# EAGLE design MCP Teensy (EAGLE 7.6.0)
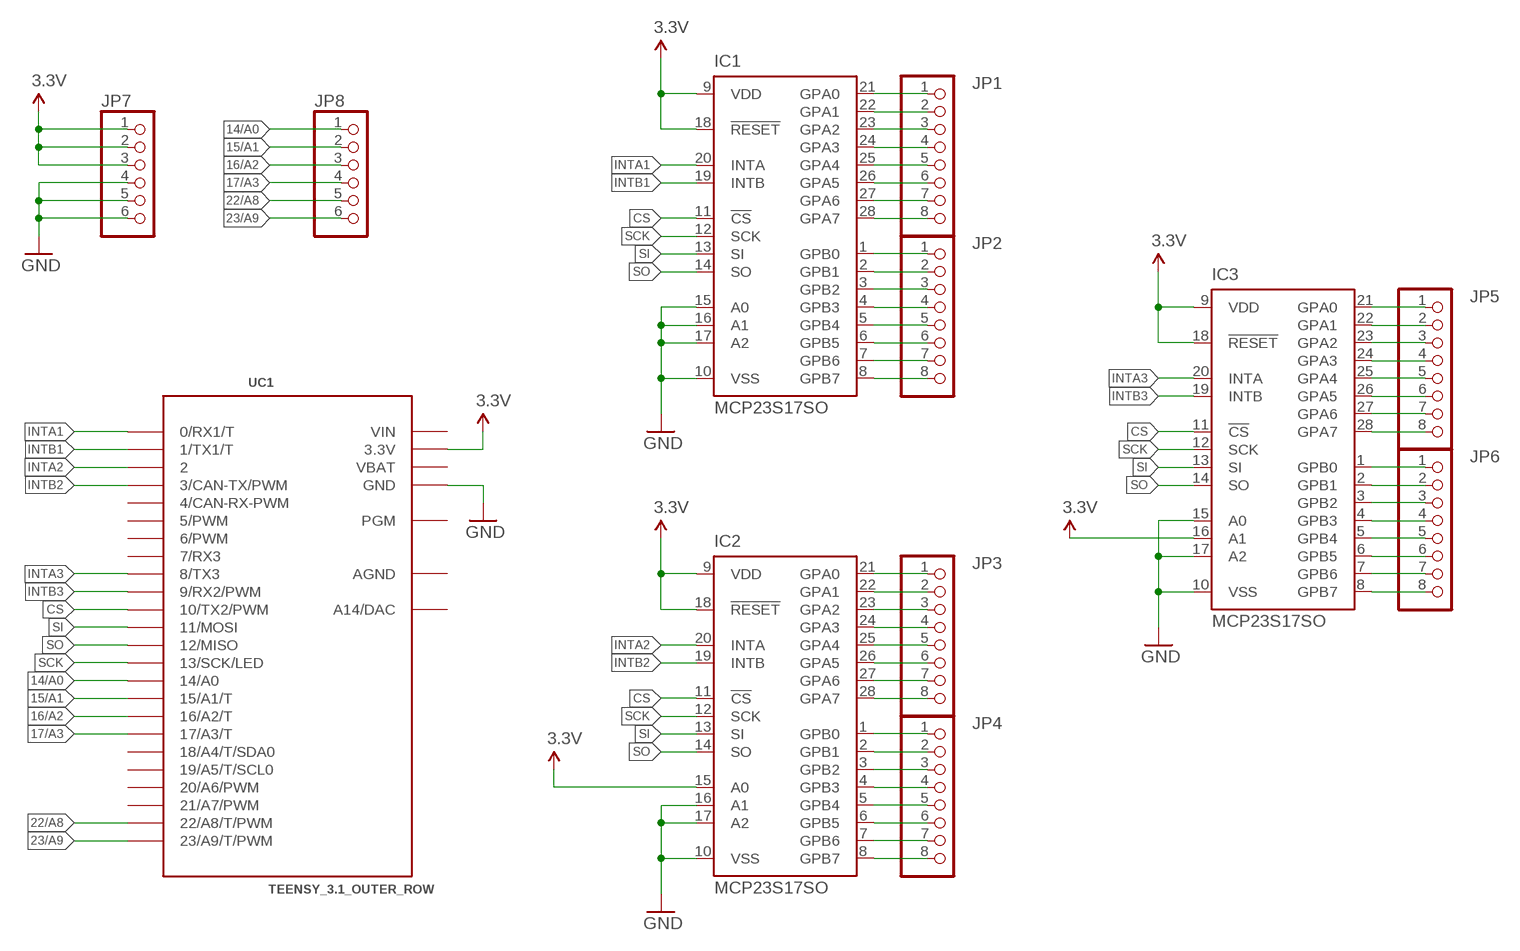
[diagram p0: schematic, sheet 1]

## Parts
IC1  MCP23S17SO  [SO28W]
IC2  MCP23S17SO  [SO28W]
IC3  MCP23S17SO  [SO28W]
JP1  PINHD-1X8LOCK  [1X08-LOCK]
JP2  PINHD-1X8LOCK  [1X08-LOCK]
JP3  PINHD-1X8LOCK  [1X08-LOCK]
JP4  PINHD-1X8LOCK  [1X08-LOCK]
JP5  PINHD-1X8LOCK  [1X08-LOCK]
JP6  PINHD-1X8LOCK  [1X08-LOCK]
JP7  PINHD-1X6LOCK  [1X06-BIGLOCK]
JP8  PINHD-1X6LOCK  [1X06-BIGLOCK]
UC1  TEENSY_3.1_OUTER_ROW  [TEENSY3-OUTER_ROW]

## Nets
3.3V: IC1.9(VDD) IC1.18(!RESET) IC2.9(VDD) IC2.15(A0) IC2.18(!RESET) IC3.9(VDD) IC3.16(A1) IC3.18(!RESET) JP7.1 JP7.2 JP7.3 UC1.3.3V UC1.3.3V1(3.3V)
14/A0: JP8.1 UC1.14/A0
15/A1: JP8.2 UC1.15/A1(15/A1/T)
16/A2: JP8.3 UC1.16/A2(16/A2/T)
17/A3: JP8.4 UC1.17/A3(17/A3/T)
22/A8: JP8.5 UC1.22/A8(22/A8/T/PWM)
23/A9: JP8.6 UC1.23/A9(23/A9/T/PWM)
CS: IC1.11(!CS) IC2.11(!CS) IC3.11(!CS) UC1.10(10/TX2/PWM)
GND: IC1.10(VSS) IC1.15(A0) IC1.16(A1) IC1.17(A2) IC2.10(VSS) IC2.16(A1) IC2.17(A2) IC3.10(VSS) IC3.15(A0) IC3.17(A2) JP7.4 JP7.5 JP7.6 UC1.GND UC1.GND1(GND)
INTA1: IC1.20(INTA) UC1.0(0/RX1/T)
INTA2: IC2.20(INTA) UC1.2
INTA3: IC3.20(INTA) UC1.8(8/TX3)
INTB1: IC1.19(INTB) UC1.1(1/TX1/T)
INTB2: IC2.19(INTB) UC1.3(3/CAN-TX/PWM)
INTB3: IC3.19(INTB) UC1.9(9/RX2/PWM)
N$1: IC1.21(GPA0) JP1.1
N$2: IC1.22(GPA1) JP1.2
N$3: IC1.23(GPA2) JP1.3
N$4: IC1.24(GPA3) JP1.4
N$5: IC1.25(GPA4) JP1.5
N$6: IC1.26(GPA5) JP1.6
N$7: IC1.27(GPA6) JP1.7
N$8: IC1.28(GPA7) JP1.8
N$9: IC1.1(GPB0) JP2.1
N$10: IC1.2(GPB1) JP2.2
N$11: IC1.3(GPB2) JP2.3
N$12: IC1.4(GPB3) JP2.4
N$13: IC1.5(GPB4) JP2.5
N$14: IC1.6(GPB5) JP2.6
N$15: IC1.7(GPB6) JP2.7
N$16: IC1.8(GPB7) JP2.8
N$17: IC2.21(GPA0) JP3.1
N$18: IC2.22(GPA1) JP3.2
N$19: IC2.23(GPA2) JP3.3
N$20: IC2.24(GPA3) JP3.4
N$21: IC2.25(GPA4) JP3.5
N$22: IC2.26(GPA5) JP3.6
N$26: IC2.27(GPA6) JP3.7
N$27: IC2.28(GPA7) JP3.8
N$28: IC2.1(GPB0) JP4.1
N$29: IC2.2(GPB1) JP4.2
N$30: IC2.3(GPB2) JP4.3
N$31: IC2.4(GPB3) JP4.4
N$32: IC2.5(GPB4) JP4.5
N$33: IC2.6(GPB5) JP4.6
N$34: IC2.7(GPB6) JP4.7
N$35: IC2.8(GPB7) JP4.8
N$39: IC3.21(GPA0) JP5.1
N$40: IC3.22(GPA1) JP5.2
N$41: IC3.23(GPA2) JP5.3
N$42: IC3.24(GPA3) JP5.4
N$43: IC3.25(GPA4) JP5.5
N$44: IC3.26(GPA5) JP5.6
N$45: IC3.27(GPA6) JP5.7
N$46: IC3.28(GPA7) JP5.8
N$47: IC3.1(GPB0) JP6.1
N$48: IC3.2(GPB1) JP6.2
N$49: IC3.3(GPB2) JP6.3
N$50: IC3.4(GPB3) JP6.4
N$51: IC3.5(GPB4) JP6.5
N$52: IC3.6(GPB5) JP6.6
N$53: IC3.7(GPB6) JP6.7
N$54: IC3.8(GPB7) JP6.8
SCK: IC1.12(SCK) IC2.12(SCK) IC3.12(SCK) UC1.13(13/SCK/LED)
SI: IC1.13(SI) IC2.13(SI) IC3.13(SI) UC1.11(11/MOSI)
SO: IC1.14(SO) IC2.14(SO) IC3.14(SO) UC1.12(12/MISO)
Unconnected: UC1.4(4/CAN-RX-PWM) UC1.5(5/PWM) UC1.6(6/PWM) UC1.7(7/RX3) UC1.18/A4(18/A4/T/SDA0) UC1.19/A5(19/A5/T/SCL0) UC1.20/A6(20/A6/PWM) UC1.21/A7(21/A7/PWM) UC1.PGM UC1.RESET/DAC(A14/DAC)

## Power pins joined to a net without a drawn wire
AGND: UC1.AGND
VBAT: UC1.VBAT
VIN: UC1.VIN

## Library data of the parts
IC1-IC3 = microchip:MCP23S17: http://ww1.microchip.com/downloads/en/DeviceDoc/21952a.pdf Source: http://ww1.microchip.com/downloads/en/DeviceDoc/21952a.pdf; MF: MICROCHIP; MPN: MCP23S17-E/SO; OC_FARNELL: unknown; OC_NEWARK: 31K2950
JP1-JP6 = adafruit:PINHD-1X8: PIN HEADER
JP7 JP8 = adafruit:PINHD-1X6: PIN HEADER
UC1 = Teensy_3_and_LC_Series_Boards_v1.1:TEENSY_3.1_OUTER_ROW: Footprint for Teensy 3.1 or 3.2 board using all pin connections on the outer perimeter

## Board
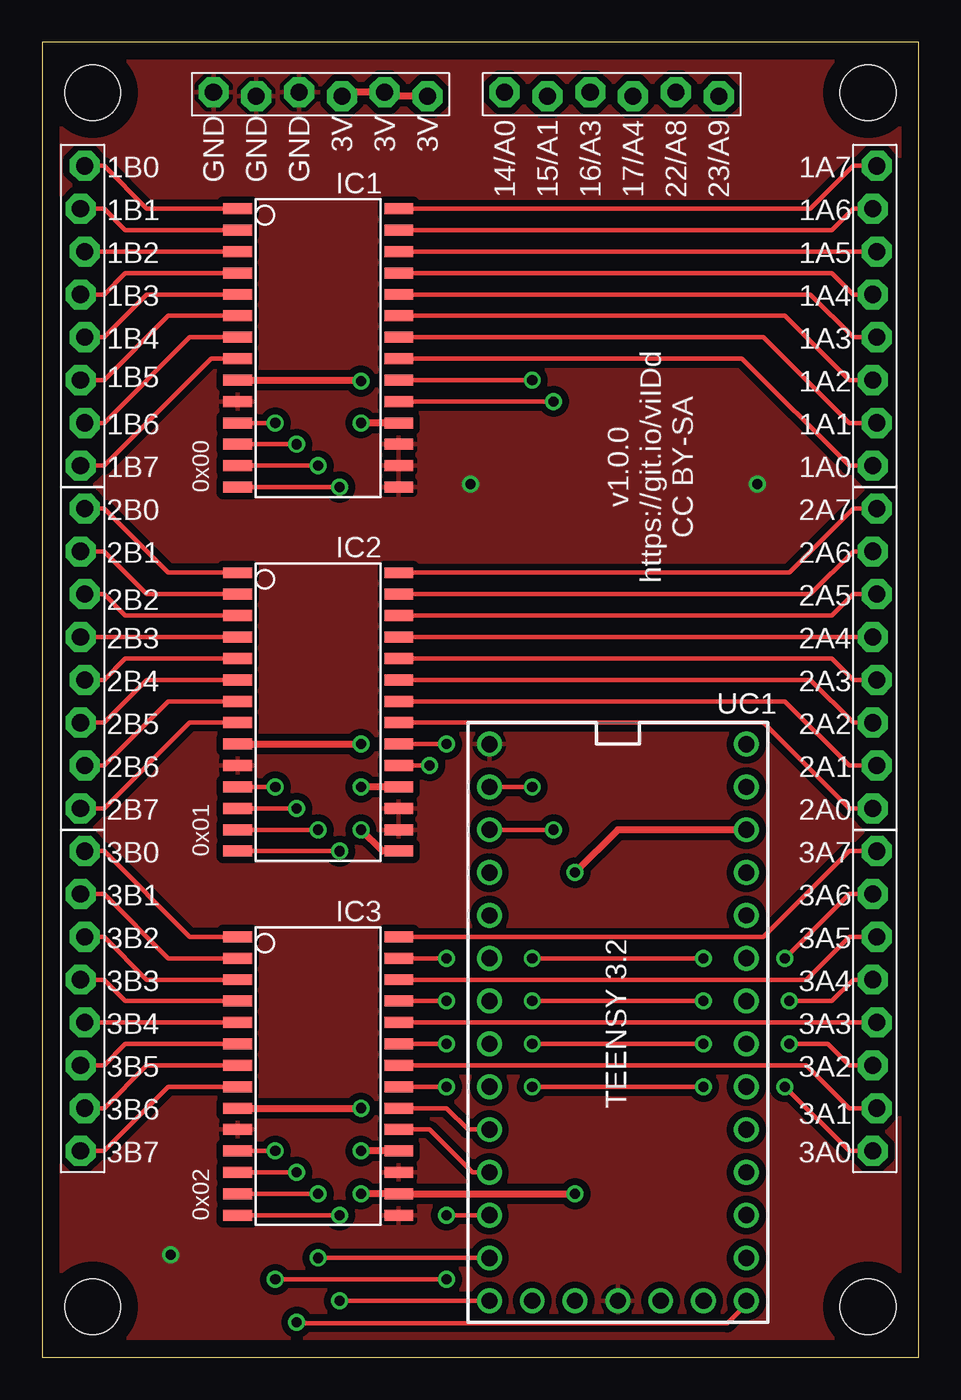
[diagram p1: board, top side]
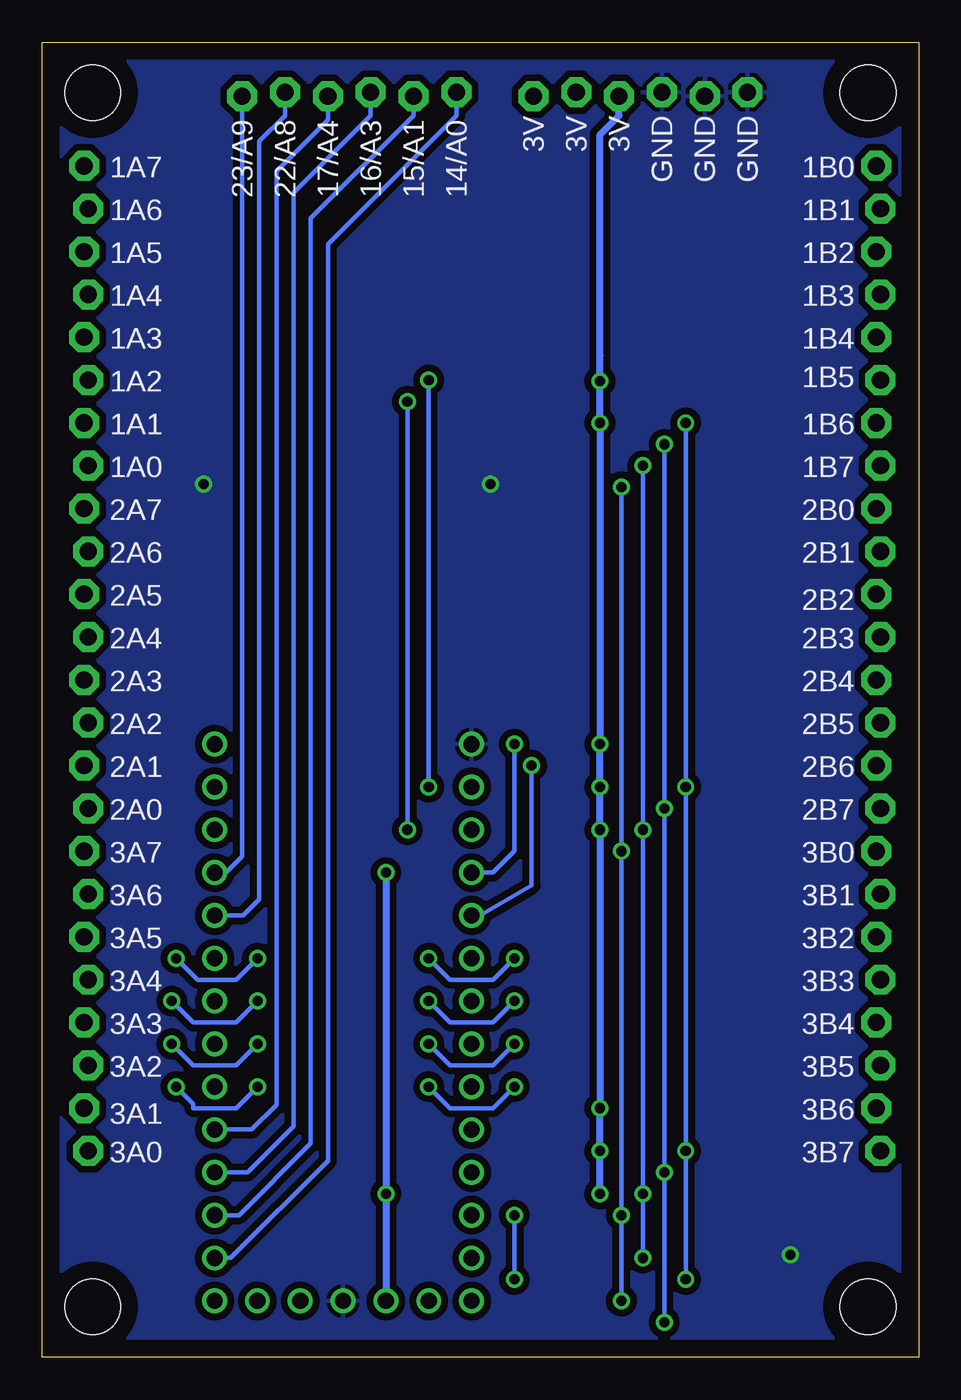
[diagram p2: board, bottom side, seen from below]

Size 52 x 78 mm. Coordinates in mm from the lower left corner, seen from the top.
Outline: 0,0 52,0 52,78 0,78 0,0
Copper layers (1*16): Top 0.035mm / dielectric 1.5mm / Bottom 0.035mm
Design rules "default": minimum track width 10mil, minimum drill 24mil, track to track 8mil, track to pad 8mil, pad to pad 8mil, via to via 8mil, smd to smd 8mil, copper to edge 40mil, drill to drill 8mil, minimum pad ring 10mil, minimum via ring 8mil, stop-mask expansion 4mil, vias tented up to drill 0mil, thermal gap 10mil

### Footprints (pad centres in the part's own frame; a part is rotated, then mirrored left to right if it is on the bottom)
SO28W = smd 0.65 x 1.7: 1 -7.62,-4.78; 2 -6.35,-4.78; 3 -5.08,-4.78; 4 -3.81,-4.78; 5 -2.54,-4.78; 6 -1.27,-4.78; 7 0,-4.78; 8 1.27,-4.78; 9 2.54,-4.78; 10 3.81,-4.78; 11 5.08,-4.78; 12 6.35,-4.78; 13 7.62,-4.78; 14 8.89,-4.78; 15 8.89,4.78; 16 7.62,4.78; 17 6.35,4.78; 18 5.08,4.78; 19 3.81,4.78; 20 2.54,4.78; 21 1.27,4.78; 22 0,4.78; 23 -1.27,4.78; 24 -2.54,4.78; 25 -3.81,4.78; 26 -5.08,4.78; 27 -6.35,4.78; 28 -7.62,4.78
1X08-LOCK = drill 1.016 pad 1.778 octagon: 1 -8.89,0.127; 2 -6.35,-0.127; 3 -3.81,0.127; 4 -1.27,-0.127; 5 1.27,0.127; 6 3.81,-0.127; 7 6.35,0.127; 8 8.89,-0.127
1X06-BIGLOCK = drill 1.016 pad 1.778 octagon: 1 -6.35,0.127; 2 -3.81,-0.127; 3 -1.27,0.127; 4 1.27,-0.127; 5 3.81,0.127; 6 6.35,-0.127
STAND-OFF = hole 3.302: 0,0
TEENSY3-OUTER_ROW = drill 0.965: 0 -7.62,13.97; 1 -7.62,11.43; 2 -7.62,8.89; 3 -7.62,6.35; 3.3V 7.62,11.43; 3.3V1 -2.54,-16.51; 4 -7.62,3.81; 5 -7.62,1.27; 6 -7.62,-1.27; 7 -7.62,-3.81; 8 -7.62,-6.35; 9 -7.62,-8.89; 10 -7.62,-11.43; 11 -7.62,-13.97; 12 -7.62,-16.51; 13 7.62,-16.51; 14/A0 7.62,-13.97; 15/A1 7.62,-11.43; 16/A2 7.62,-8.89; 17/A3 7.62,-6.35; 18/A4 7.62,-3.81; 19/A5 7.62,-1.27; 20/A6 7.62,1.27; 21/A7 7.62,3.81; 22/A8 7.62,6.35; 23/A9 7.62,8.89; AGND 7.62,13.97; GND -7.62,16.51; GND1 0,-16.51; PGM 2.54,-16.51; RESET/DAC 5.08,-16.51; VBAT -5.08,-16.51; VIN 7.62,16.51

### Placement (x,y rotation side)
IC1  16.37,60.5 270 top
IC2  16.37,38.91 270 top
IC3  16.37,17.32 270 top
JP1  49.39,61.77 90 top
JP2  2.4,61.77 270 top
JP3  49.39,41.45 90 top
JP4  2.4,41.45 270 top
JP5  49.39,21.13 90 top
JP6  2.4,21.13 270 top
JP7  16.51,74.91 180 top
JP8  33.78,74.91 0 top
U$2  [STAND-OFF]  3,75 0 top
U$3  [STAND-OFF]  3,3 0 top
U$4  [STAND-OFF]  49,75 0 top
U$5  [STAND-OFF]  49,3 0 top
UC1  34.15,19.86 0 top

### Tracks (layer width: path | path; a pad name or v marks a point on that pad's centre or on a via)
3.3V  (via drill 0.6)
  Top 0.406: IC1.18 v18.91,55.42 | IC2.15 20.18,30.02 v18.91,31.29 | IC2.9 v18.91,36.37 | IC2.18 v18.91,33.83 | IC3.9 v18.91,14.78 | IC3.18 v18.91,12.24 | v18.91,9.7 IC3.16 v31.61,9.7 | UC1.3.3V 34.15,31.29 v31.61,28.75 | JP7.3 18.03,75.04 JP7.2 20.57,74.79 JP7.1 | IC1.9 18.85,57.96 v18.91,57.9
  Bottom 0.406: v18.91,9.7 v18.91,12.24 v18.91,14.78 v18.91,31.29 v18.91,33.83 v18.91,36.37 v18.91,55.42 v18.91,57.9 18.91,59.42 18.91,72.51 17.78,73.64 JP7.3 | UC1.3.3V1 v31.61,9.7 v31.61,28.75
14/A0
  Bottom 0.254: UC1.14/A0 40.83,5.89 35.05,11.67 35.05,66.02 27.43,73.64 JP8.1
15/A1
  Bottom 0.254: UC1.15/A1 40.32,8.43 36.07,12.68 36.07,67.55 29.97,73.64 JP8.2
16/A2
  Bottom 0.254: UC1.16/A2 39.81,10.97 37.08,13.7 37.08,69.07 32.51,73.64 JP8.3
17/A3
  Bottom 0.254: UC1.17/A3 39.56,13.51 38.1,14.97 38.1,70.34 35.05,73.39 JP8.4
22/A8
  Bottom 0.254: UC1.22/A8 40.07,26.21 39.12,27.16 39.12,72.12 37.59,73.64 JP8.5
23/A9
  Bottom 0.254: UC1.23/A9 41.08,28.75 40.13,29.7 40.13,70.85 40.13,71.87 JP8.6
CS  (via drill 0.6)
  Top 0.254: IC1.11 v13.83,55.42 | IC2.11 v13.83,33.83 | v13.83,12.24 IC3.11 | UC1.10 v23.99,8.43 | v23.99,4.62 v13.83,4.62
  Bottom 0.254: v13.83,55.42 v13.83,33.83 v13.83,12.24 v13.83,4.62 | v23.99,8.43 v23.99,4.62
GND  (via drill 0.6)
  other vias: 25.4,51.8 7.62,6.08 42.42,51.8
  pour Bottom (isolate 0.406): 0,78.47 52.07,78.47 52.07,-0.27 0,-0.27
  pour Top (isolate 0.406): 0,78.47 52.07,78.47 52.07,-0.27 0,-0.27
INTA1  (via drill 0.6)
  Top 0.254: UC1.0 v29.07,33.83 | v29.07,57.96 IC1.20
  Bottom 0.254: v29.07,33.83 v29.07,57.96
INTA2  (via drill 0.6)
  Top 0.254: v23.99,36.37 IC2.20
  Bottom 0.254: UC1.2 25.26,28.75 23.99,30.02 v23.99,36.37
INTA3
  Top 0.254: UC1.8 25.26,13.51 23.99,14.78 IC3.20
INTB1  (via drill 0.6)
  Top 0.254: IC1.19 v30.34,56.69 | v30.34,31.29 UC1.1
  Bottom 0.254: v30.34,56.69 v30.34,31.29
INTB2  (via drill 0.6)
  Top 0.254: v22.97,35.1 IC2.19
  Bottom 0.254: UC1.3 26.02,26.21 22.97,27.99 v22.97,35.1
INTB3
  Top 0.254: UC1.9 25.51,10.97 22.97,13.51 IC3.19
N$1
  Top 0.254: IC1.21 41.52,59.23 47.87,52.88 JP1.1
N$2
  Top 0.254: IC1.22 42.79,60.5 47.87,55.42 JP1.2
N$3
  Top 0.254: IC1.23 44.06,61.77 47.87,57.96 JP1.3
N$4
  Top 0.254: IC1.24 45.58,63.04 48.12,60.5 JP1.4
N$5
  Top 0.254: IC1.25 46.85,64.31 48.12,63.04 JP1.5
N$6
  Top 0.254: IC1.26 JP1.6
N$7
  Top 0.254: IC1.27 46.85,66.85 48.12,68.12 JP1.7
N$8
  Top 0.254: IC1.28 45.58,68.12 48.12,70.66 JP1.8
N$9
  Top 0.254: IC1.1 6.21,68.12 3.67,70.66 JP2.1
N$10
  Top 0.254: IC1.2 4.94,66.85 3.67,68.12 JP2.2
N$11
  Top 0.254: IC1.3 JP2.3
N$12
  Top 0.254: IC1.4 4.94,64.31 3.67,63.04 JP2.4
N$13
  Top 0.254: IC1.5 6.21,63.04 3.67,60.5 JP2.5
N$14
  Top 0.254: IC1.6 7.48,61.77 3.67,57.96 JP2.6
N$15
  Top 0.254: IC1.7 8.75,60.5 3.67,55.42 JP2.7
N$16
  Top 0.254: IC1.8 10.02,59.23 3.67,52.88 JP2.8
N$17
  Top 0.254: IC2.21 42.79,37.64 47.87,32.56 JP3.1
N$18
  Top 0.254: IC2.22 44.06,38.91 47.87,35.1 JP3.2
N$19
  Top 0.254: IC2.23 45.58,40.18 48.12,37.64 JP3.3
N$20
  Top 0.254: IC2.24 46.85,41.45 48.12,40.18 JP3.4
N$21
  Top 0.254: IC2.25 JP3.5
N$22
  Top 0.254: IC2.26 46.85,43.99 48.12,45.26 JP3.6
N$26
  Top 0.254: JP3.7 48.12,47.8 45.58,45.26 IC2.27
N$27
  Top 0.254: IC2.28 44.31,46.53 48.12,50.34 JP3.8
N$28
  Top 0.254: IC2.1 7.48,46.53 3.67,50.34 JP4.1
N$29
  Top 0.254: IC2.2 6.21,45.26 3.67,47.8 JP4.2
N$30
  Top 0.254: IC2.3 4.94,43.99 3.67,45.26 JP4.3
N$31
  Top 0.254: IC2.4 JP4.4
N$32
  Top 0.254: IC2.5 4.94,41.45 3.67,40.18 JP4.5
N$33
  Top 0.254: IC2.6 6.21,40.18 3.67,37.64 JP4.6
N$34
  Top 0.254: IC2.7 7.48,38.91 3.67,35.1 JP4.7
N$35
  Top 0.254: IC2.8 8.75,37.64 3.67,32.56 JP4.8
N$39  (via drill 0.6)
  Top 0.254: v44.06,16.05 47.87,12.24 JP5.1 | IC3.21 v23.99,16.05 | v29.07,16.05 v39.23,16.05
  Bottom 0.254: v23.99,16.05 25.26,14.78 27.8,14.78 v29.07,16.05 | v39.23,16.05 40.5,14.78 43.04,14.78 43.04,15.03 v44.06,16.05
N$40
  Top 0.254: IC3.22 45.33,17.32 47.87,14.78 JP5.2
N$41  (via drill 0.6)
  Top 0.254: JP5.3 47.87,17.32 46.6,18.59 v44.31,18.59 | IC3.23 v23.99,18.59 | v29.07,18.59 v39.23,18.59
  Bottom 0.254: v23.99,18.59 25.26,17.32 27.8,17.32 v29.07,18.59 | v39.23,18.59 40.5,17.32 43.04,17.32 v44.31,18.59
N$42
  Top 0.254: IC3.24 JP5.4
N$43  (via drill 0.6)
  Top 0.254: JP5.5 48.12,22.4 46.85,21.13 v44.31,21.13 | IC3.25 v23.99,21.13 | v29.07,21.13 v39.23,21.13
  Bottom 0.254: v23.99,21.13 25.26,19.86 27.8,19.86 v29.07,21.13 | v39.23,21.13 40.5,19.86 43.04,19.86 v44.31,21.13
N$44
  Top 0.254: IC3.26 45.33,22.4 47.87,24.94 JP5.6
N$45  (via drill 0.6)
  Top 0.254: v44.06,23.67 47.87,27.48 JP5.7 | IC3.27 v23.99,23.67 | v29.07,23.67 v39.23,23.67
  Bottom 0.254: v23.99,23.67 25.26,22.4 27.8,22.4 v29.07,23.67 | v39.23,23.67 40.5,22.4 42.79,22.4 v44.06,23.67
N$46
  Top 0.254: IC3.28 42.79,24.94 47.87,30.02 JP5.8
N$47
  Top 0.254: IC3.1 8.75,24.94 3.67,30.02 JP6.1
N$48
  Top 0.254: IC3.2 7.48,23.67 3.67,27.48 JP6.2
N$49
  Top 0.254: IC3.3 6.21,22.4 3.67,24.94 JP6.3
N$50
  Top 0.254: IC3.4 4.94,21.13 3.67,22.4 JP6.4
N$51
  Top 0.254: IC3.5 JP6.5
N$52
  Top 0.254: IC3.6 4.94,18.59 3.67,17.32 JP6.6
N$53
  Top 0.254: IC3.7 6.21,17.32 3.67,14.78 JP6.7
N$54
  Top 0.254: IC3.8 7.48,16.05 3.67,12.24 JP6.8
SCK  (via drill 0.6)
  Top 0.254: IC1.12 v15.1,54.15 | IC2.12 v15.1,32.56 | IC3.12 v15.1,10.97 | UC1.13 41.77,3.15 40.64,2.02 15.16,2.02 v15.1,2.08
  Bottom 0.254: v15.1,54.15 v15.1,32.56 v15.1,10.97 v15.1,2.08
SI  (via drill 0.6)
  Top 0.254: IC1.13 v16.37,52.88 | IC2.13 v16.37,31.29 | IC3.13 v16.37,9.7 | UC1.11 v16.37,5.89
  Bottom 0.254: v16.37,52.88 v16.37,31.29 v16.37,9.7 v16.37,5.89
SO  (via drill 0.6)
  Top 0.254: IC1.14 v17.64,51.61 | IC2.14 v17.64,30.02 | v17.64,8.43 IC3.14 | UC1.12 v17.64,3.35
  Bottom 0.254: v17.64,51.61 v17.64,30.02 | v17.64,30.02 17.64,28.75 | v17.64,30.02 v17.64,8.43 v17.64,3.35

### Text on the board
tPlace: GND | GND | GND | 3V | 3V | 3V | 14/A0 | 15/A1 | 16/A3 | 17/A4 | 22/A8 | 23/A9 | 1B0 | 1A7 | 1B1 | 1A6 | 1B2 | 1A5 | 1B3 | 1A4 | 1B4 | 1A3 | 1B5 | 1A2 | 1B6 | 1A1 | 1B7 | v1.0.0 / https://git.io/viIDd / CC BY-SA | 1A0 | 0x00 | 2B0 | 2A7 | 2B1 | 2A6 | 2B2 | 2A5 | 2B3 | 2A4 | 2B4 | 2A3 | 2B5 | 2A2 | 2B6 | 2A1 | 2B7 | 2A0 | 3B0 | 0x01 | 3A7 | 3B1 | 3A6 | 3B2 | 3A5 | 3B3 | 3A4 | 3B4 | TEENSY 3.2 | 3A3 | 3B5 | 3A2 | 3B6 | 3A1 | 3B7 | 3A0 | 0x02
bPlace: GND | GND | GND | 3V | 3V | 3V | 14/A0 | 15/A1 | 16/A3 | 17/A4 | 22/A8 | 23/A9 | 1B0 | 1A7 | 1B1 | 1A6 | 1B2 | 1A5 | 1B3 | 1A4 | 1B4 | 1A3 | 1B5 | 1A2 | 1B6 | 1A1 | 1B7 | 1A0 | 2B0 | 2A7 | 2B1 | 2A6 | 2B2 | 2A5 | 2B3 | 2A4 | 2B4 | 2A3 | 2B5 | 2A2 | 2B6 | 2A1 | 2B7 | 2A0 | 3B0 | 3A7 | 3B1 | 3A6 | 3B2 | 3A5 | 3B3 | 3A4 | 3B4 | 3A3 | 3B5 | 3A2 | 3B6 | 3A1 | 3B7 | 3A0